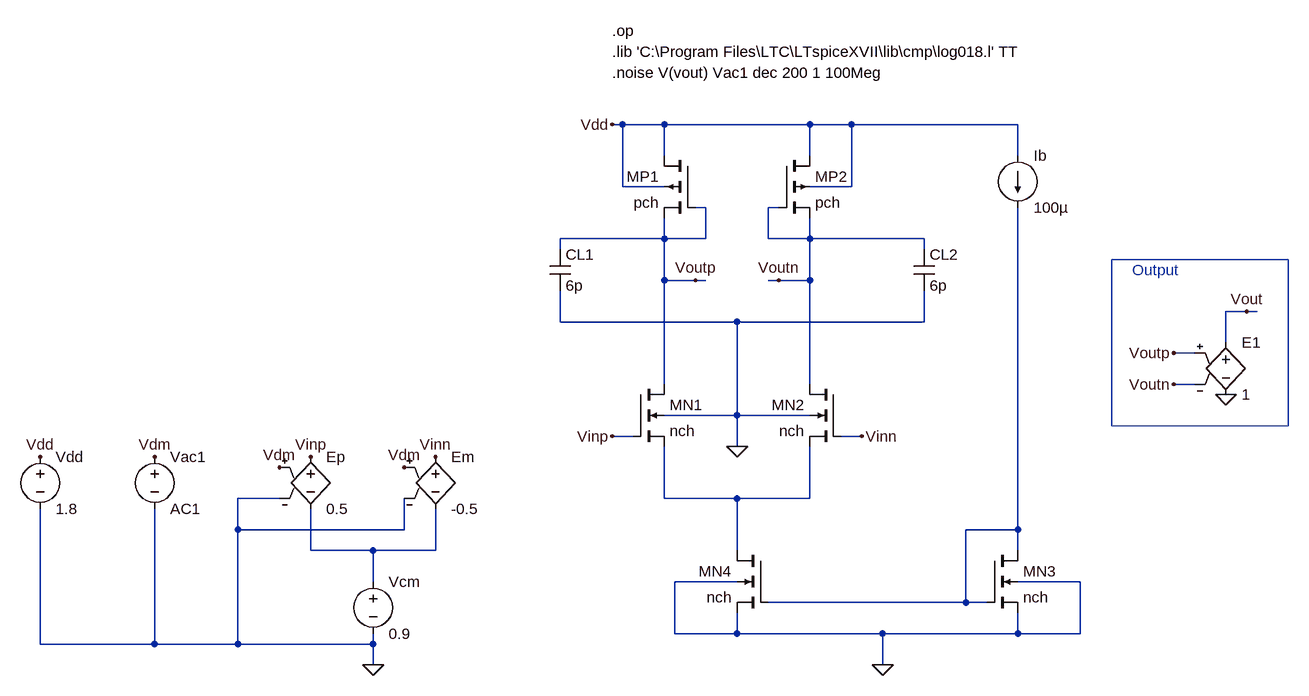
[diagram p0: schematic q4d.asc]
q4d.asc, the LTspice schematic file:
Version 4
SHEET 1 932 996
WIRE -96 128 -112 128
WIRE -32 128 -96 128
WIRE 192 128 -32 128
WIRE 256 128 192 128
WIRE 512 128 256 128
WIRE -32 176 -32 128
WIRE 192 176 192 128
WIRE 512 176 512 128
WIRE -96 224 -96 128
WIRE -32 224 -96 224
WIRE 256 224 256 128
WIRE 256 224 192 224
WIRE 32 256 16 256
WIRE 144 256 128 256
WIRE -32 304 -32 272
WIRE -32 304 -192 304
WIRE 32 304 32 256
WIRE 32 304 -32 304
WIRE 128 304 128 256
WIRE 192 304 192 272
WIRE 192 304 128 304
WIRE 368 304 192 304
WIRE -192 320 -192 304
WIRE 368 320 368 304
WIRE -32 368 -32 304
WIRE 16 368 -32 368
WIRE 32 368 16 368
WIRE 144 368 128 368
WIRE 192 368 192 304
WIRE 192 368 144 368
WIRE 864 416 832 416
WIRE 880 416 864 416
WIRE -192 432 -192 384
WIRE 80 432 -192 432
WIRE 368 432 368 384
WIRE 368 432 80 432
WIRE 832 464 832 416
WIRE 784 480 752 480
WIRE -32 528 -32 368
WIRE 192 528 192 368
WIRE 784 528 752 528
WIRE 80 576 80 432
WIRE 80 576 -32 576
WIRE 192 576 80 576
WIRE -80 608 -112 608
WIRE 272 608 240 608
WIRE 80 624 80 576
WIRE -624 704 -688 704
WIRE -32 704 -32 624
WIRE 80 704 -32 704
WIRE 192 704 192 624
WIRE 192 704 80 704
WIRE -688 752 -688 704
WIRE -432 752 -432 704
WIRE -432 752 -688 752
WIRE 512 752 512 256
WIRE 512 752 432 752
WIRE -576 784 -576 720
WIRE -480 784 -576 784
WIRE -384 784 -384 720
WIRE -384 784 -480 784
WIRE 80 784 80 704
WIRE 512 784 512 752
WIRE -480 832 -480 784
WIRE 80 832 -16 832
WIRE 608 832 512 832
WIRE 432 864 432 752
WIRE 432 864 128 864
WIRE 464 864 432 864
WIRE -16 912 -16 832
WIRE 80 912 80 880
WIRE 80 912 -16 912
WIRE 304 912 80 912
WIRE 512 912 512 880
WIRE 512 912 304 912
WIRE 608 912 608 832
WIRE 608 912 512 912
WIRE -992 928 -992 720
WIRE -816 928 -816 720
WIRE -816 928 -992 928
WIRE -688 928 -688 752
WIRE -688 928 -816 928
WIRE -480 928 -480 912
WIRE -480 928 -688 928
WIRE -480 960 -480 928
WIRE 304 960 304 912
FLAG 16 368 Voutp
FLAG 144 368 Voutn
FLAG 80 624 0
FLAG -112 608 Vinp
FLAG 272 608 Vinn
FLAG -112 128 Vdd
FLAG 304 960 0
FLAG -992 640 Vdd
FLAG -816 640 Vdm
FLAG -624 656 Vdm
FLAG -432 656 Vdm
FLAG -576 640 Vinp
FLAG -384 640 Vinn
FLAG -480 960 0
FLAG 752 480 Voutp
FLAG 752 528 Voutn
FLAG 832 544 0
FLAG 864 416 Vout
SYMBOL pmos4 16 176 M0
SYMATTR InstName MP1
SYMATTR Value pch
SYMATTR Value2 l=3u w=8.5u
SYMBOL pmos4 144 176 R0
SYMATTR InstName MP2
SYMATTR Value pch
SYMATTR Value2 l=3u w=8.5u
SYMBOL nmos4 -80 528 R0
SYMATTR InstName MN1
SYMATTR Value nch
SYMATTR Value2 l=3u w=85u
SYMBOL nmos4 240 528 M0
SYMATTR InstName MN2
SYMATTR Value nch
SYMATTR Value2 l=3u w=85u
SYMBOL nmos4 128 784 M0
SYMATTR InstName MN4
SYMATTR Value nch
SYMATTR Value2 l=0.18u w=5u
SYMBOL nmos4 464 784 R0
SYMATTR InstName MN3
SYMATTR Value nch
SYMATTR Value2 l=0.18u w=5u
SYMBOL cap -208 320 R0
SYMATTR InstName CL1
SYMATTR Value 6p
SYMBOL cap 352 320 R0
SYMATTR InstName CL2
SYMATTR Value 6p
SYMBOL current 512 176 R0
WINDOW 123 0 0 Left 0
WINDOW 39 0 0 Left 0
SYMATTR InstName Ib
SYMATTR Value 100µ
SYMBOL voltage -992 624 R0
SYMATTR InstName Vdd
SYMATTR Value 1.8
SYMBOL voltage -816 624 R0
SYMATTR InstName Vac1
SYMATTR Value AC1
SYMBOL voltage -480 816 R0
SYMATTR InstName Vcm
SYMATTR Value 0.9
SYMBOL e -576 624 R0
SYMATTR InstName Ep
SYMATTR Value 0.5
SYMBOL e -384 624 R0
SYMATTR InstName Em
SYMATTR Value -0.5
SYMBOL e 832 448 R0
SYMATTR InstName E1
SYMATTR Value 1
TEXT -112 16 Left 2 !.lib 'C:\\Program Files\\LTC\\LTspiceXVII\\lib\\cmp\\log018.l' TT
TEXT -112 48 Left 2 !.noise V(vout) Vac1 dec 200 1 100Meg
TEXT -112 -16 Left 2 !.op
TEXT 688 352 Left 2 ;Output
RECTANGLE Normal 928 592 656 336

The netlist it stands for:
* q4d.asc
MP1 Vdd Voutp Voutp Vdd pch l=3u w=8.5u
MP2 Vdd Voutn Voutn Vdd pch l=3u w=8.5u
MN1 Voutp Vinp N001 0 nch l=3u w=85u
MN2 Voutn Vinn N001 0 nch l=3u w=85u
MN4 N001 N002 0 0 nch l=0.18u w=5u
MN3 N002 N002 0 0 nch l=0.18u w=5u
CL1 Voutp 0 6p
CL2 Voutn 0 6p
Ib Vdd N002 100µ
Vdd Vdd 0 1.8
Vac1 Vdm 0 AC1
Vcm N003 0 0.9
Ep Vinp N003 Vdm 0 0.5
Em Vinn N003 Vdm 0 -0.5
E1 Vout 0 Voutp Voutn 1
.model NMOS NMOS
.model PMOS PMOS
.lib standard.mos
.lib 'C:\Program Files\LTC\LTspiceXVII\lib\cmp\log018.l' TT
.noise V(vout) Vac1 dec 200 1 100Meg
.op
* Output
.backanno
.end